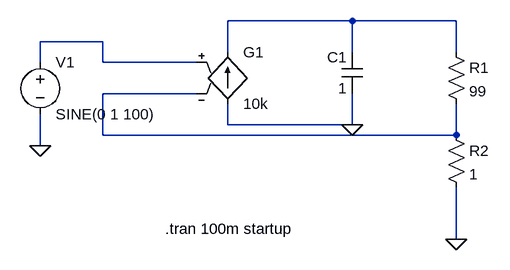
[diagram p0: schematic Draft1.asc]
Draft1.asc, the LTspice schematic file:
Version 4
SHEET 1 948 680
WIRE 736 144 544 144
WIRE 896 144 736 144
WIRE 352 176 256 176
WIRE 544 192 544 144
WIRE 736 192 736 144
WIRE 896 192 896 144
WIRE 256 208 256 176
WIRE 352 208 352 176
WIRE 496 208 352 208
WIRE 496 256 352 256
WIRE 544 304 544 272
WIRE 736 304 736 256
WIRE 736 304 544 304
WIRE 352 320 352 256
WIRE 896 320 896 272
WIRE 896 320 352 320
WIRE 256 336 256 288
WIRE 896 480 896 400
FLAG 896 480 0
FLAG 256 336 0
FLAG 736 304 0
SYMBOL g 544 176 R0
SYMATTR InstName G1
SYMATTR Value 10k
SYMBOL voltage 256 192 R0
SYMATTR InstName V1
SYMATTR Value SINE(0 1 100)
SYMATTR Value2 AC 1 0
SYMBOL cap 752 256 R180
WINDOW 0 24 56 Left 2
WINDOW 3 24 8 Left 2
SYMATTR InstName C1
SYMATTR Value 1
SYMBOL res 880 176 R0
SYMATTR InstName R1
SYMATTR Value 99
SYMBOL res 880 304 R0
SYMATTR InstName R2
SYMATTR Value 1
TEXT 448 464 Left 2 !.tran 100m startup

The netlist it stands for:
* Draft1.asc
G1 0 N001 N002 N003 10k
V1 N002 0 SINE(0 1 100) AC 1 0
C1 0 N001 1
R1 N001 N003 99
R2 N003 0 1
.tran 100m startup
.backanno
.end